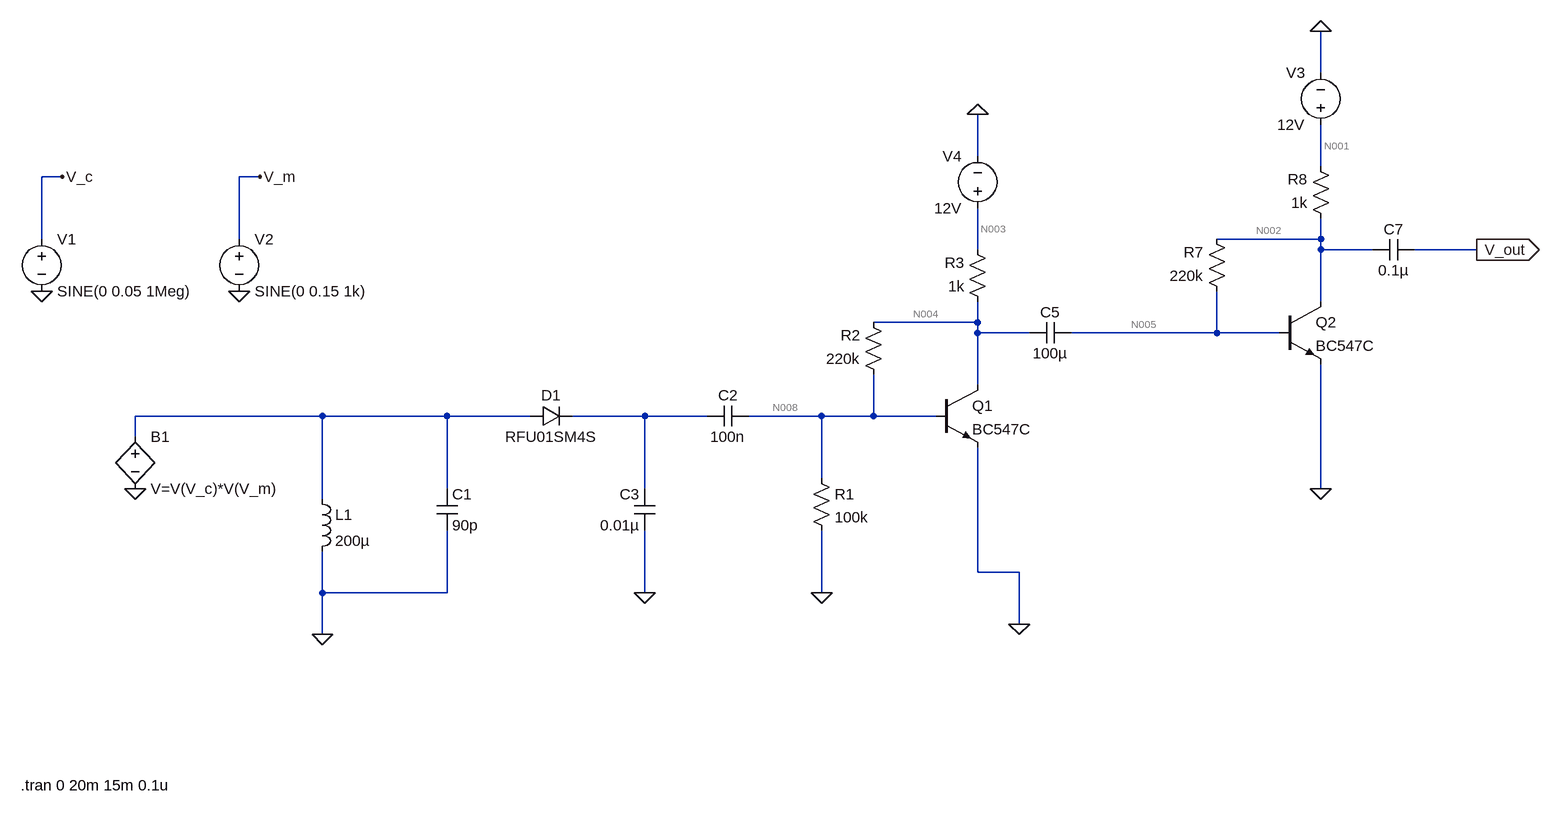
[diagram p0: schematic AM_RECEIVER_TRANSx2.asc]
AM_RECEIVER_TRANSx2.asc, the LTspice schematic file:
Version 4
SHEET 1 2160 744
WIRE 1104 -368 1104 -432
WIRE 576 -240 576 -304
WIRE 1104 -224 1104 -288
WIRE -832 -208 -864 -208
WIRE -528 -208 -560 -208
WIRE -864 -112 -864 -208
WIRE -560 -112 -560 -208
WIRE 1104 -112 1104 -144
WIRE 1104 -112 944 -112
WIRE 576 -96 576 -160
WIRE 1104 -96 1104 -112
WIRE 1184 -96 1104 -96
WIRE 1344 -96 1248 -96
WIRE 1104 -16 1104 -96
WIRE 576 16 576 -16
WIRE 576 16 416 16
WIRE 576 32 576 16
WIRE 656 32 576 32
WIRE 944 32 944 -32
WIRE 944 32 720 32
WIRE 1040 32 944 32
WIRE 576 112 576 32
WIRE -432 160 -720 160
WIRE -240 160 -432 160
WIRE -112 160 -240 160
WIRE 64 160 -48 160
WIRE 160 160 64 160
WIRE 336 160 224 160
WIRE 416 160 416 96
WIRE 416 160 336 160
WIRE 512 160 416 160
WIRE -720 192 -720 160
WIRE 336 256 336 160
WIRE -240 272 -240 160
WIRE 64 272 64 160
WIRE 1104 272 1104 80
WIRE -432 288 -432 160
WIRE 576 400 576 208
WIRE 640 400 576 400
WIRE -432 432 -432 368
WIRE -240 432 -240 336
WIRE -240 432 -432 432
WIRE 64 432 64 336
WIRE 336 432 336 336
WIRE 640 480 640 400
WIRE -432 496 -432 432
FLAG -864 -32 0
FLAG -560 -32 0
FLAG -720 272 0
FLAG -832 -208 V_c
FLAG -528 -208 V_m
FLAG 64 432 0
FLAG 336 432 0
FLAG -432 496 0
FLAG 640 480 0
FLAG 576 -304 0
FLAG 1104 -432 0
FLAG 1344 -96 V_out
IOPIN 1344 -96 Out
FLAG 1104 272 0
SYMBOL voltage -864 -128 R0
WINDOW 123 0 0 Left 0
WINDOW 39 0 0 Left 0
SYMATTR InstName V1
SYMATTR Value SINE(0 0.05 1Meg)
SYMBOL voltage -560 -128 R0
WINDOW 123 0 0 Left 0
WINDOW 39 0 0 Left 0
SYMATTR InstName V2
SYMATTR Value SINE(0 0.15 1k)
SYMBOL bv -720 176 R0
SYMATTR InstName B1
SYMATTR Value V=V(V_c)*V(V_m)
SYMBOL ind -448 272 R0
SYMATTR InstName L1
SYMATTR Value 200µ
SYMBOL cap -256 272 R0
SYMATTR InstName C1
SYMATTR Value 90p
SYMBOL diode -112 176 R270
WINDOW 0 32 32 VTop 2
WINDOW 3 0 32 VBottom 2
SYMATTR InstName D1
SYMATTR Value RFU01SM4S
SYMBOL cap 224 144 R90
WINDOW 0 0 32 VBottom 2
WINDOW 3 32 32 VTop 2
SYMATTR InstName C2
SYMATTR Value 100n
SYMBOL cap 80 336 R180
WINDOW 0 24 56 Left 2
WINDOW 3 24 8 Left 2
SYMATTR InstName C3
SYMATTR Value 0.01µ
SYMBOL res 320 240 R0
SYMATTR InstName R1
SYMATTR Value 100k
SYMBOL npn 512 112 R0
SYMATTR InstName Q1
SYMATTR Value BC547C
SYMBOL res 432 112 R180
WINDOW 0 36 76 Left 2
WINDOW 3 36 40 Left 2
SYMATTR InstName R2
SYMATTR Value 220k
SYMBOL res 592 0 R180
WINDOW 0 36 76 Left 2
WINDOW 3 36 40 Left 2
SYMATTR InstName R3
SYMATTR Value 1k
SYMBOL cap 656 48 R270
WINDOW 0 32 32 VTop 2
WINDOW 3 0 32 VBottom 2
SYMATTR InstName C5
SYMATTR Value 100µ
SYMBOL voltage 576 -144 R180
WINDOW 0 24 96 Left 2
WINDOW 3 24 16 Left 2
WINDOW 123 0 0 Left 0
WINDOW 39 0 0 Left 0
SYMATTR InstName V4
SYMATTR Value 12V
SYMBOL npn 1040 -16 R0
SYMATTR InstName Q2
SYMATTR Value BC547C
SYMBOL res 960 -16 R180
WINDOW 0 36 76 Left 2
WINDOW 3 36 40 Left 2
SYMATTR InstName R7
SYMATTR Value 220k
SYMBOL res 1120 -128 R180
WINDOW 0 36 76 Left 2
WINDOW 3 36 40 Left 2
SYMATTR InstName R8
SYMATTR Value 1k
SYMBOL cap 1184 -80 R270
WINDOW 0 32 32 VTop 2
WINDOW 3 0 32 VBottom 2
SYMATTR InstName C7
SYMATTR Value 0.1µ
SYMBOL voltage 1104 -272 R180
WINDOW 0 24 96 Left 2
WINDOW 3 24 16 Left 2
WINDOW 123 0 0 Left 0
WINDOW 39 0 0 Left 0
SYMATTR InstName V3
SYMATTR Value 12V
TEXT -896 728 Left 2 !.tran 0 20m 15m 0.1u

The netlist it stands for:
* AM_RECEIVER_TRANSx2.asc
V1 V_c 0 SINE(0 0.05 1Meg)
V2 V_m 0 SINE(0 0.15 1k)
B1 N006 0 V=V(V_c)*V(V_m)
L1 N006 0 200µ
C1 N006 0 90p
D1 N006 N007 RFU01SM4S
C2 N008 N007 100n
C3 0 N007 0.01µ
R1 N008 0 100k
Q1 N004 N008 0 0 BC547C
R2 N008 N004 220k
R3 N004 N003 1k
C5 N004 N005 100µ
V4 N003 0 12V
Q2 N002 N005 0 0 BC547C
R7 N005 N002 220k
R8 N002 N001 1k
C7 N002 V_out 0.1µ
V3 N001 0 12V
.model D D
.lib standard.dio
.model NPN NPN
.model PNP PNP
.lib standard.bjt
.tran 0 20m 15m 0.1u
.backanno
.end

* Results of the author's LTspice run, read from the files saved beside the schematic
* Operating Point, zero values left out:
*   V(n008) = 671.9 mV
*   V(n004) = 5.261 V
*   V(n003) = 12 V
*   V(n005) = 676.2 mV
*   V(n002) = 4.313 V
*   V(n001) = 12 V
*   V(v_out) = 431.3 nV
*   Ic(Q2) = 7.67 mA
*   Ib(Q2) = 16.53 µA
*   Ie(Q2) = -7.687 mA
*   Ic(Q1) = 6.718 mA
*   Ib(Q1) = 14.14 µA
*   Ie(Q1) = -6.732 mA
*   I(R8) = -7.687 mA
*   I(R7) = -16.53 µA
*   I(R3) = -6.739 mA
*   I(R2) = -20.86 µA
*   I(R1) = 6.719 µA
*   I(V3) = -7.687 mA
*   I(V4) = -6.739 mA